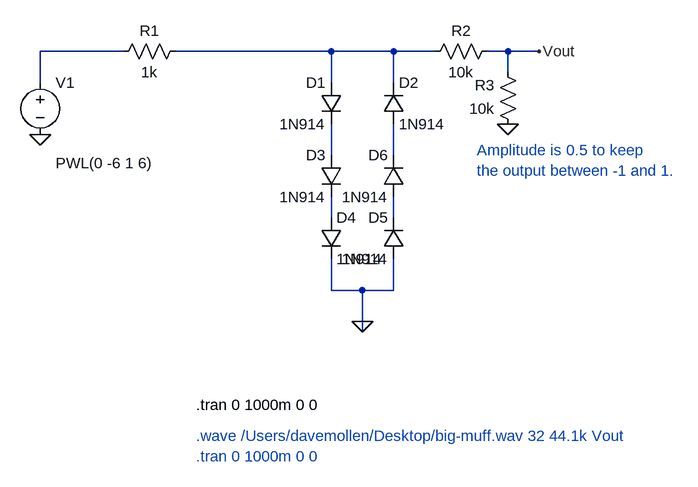
[diagram p0: schematic clipper.asc]
clipper.asc, the LTspice schematic file:
Version 4
SHEET 1 3044 724
WIRE 144 -176 16 -176
WIRE 464 -176 224 -176
WIRE 560 -176 464 -176
WIRE 624 -176 560 -176
WIRE 736 -176 704 -176
WIRE 784 -176 736 -176
WIRE 736 -144 736 -176
WIRE 16 -128 16 -176
WIRE 464 -128 464 -176
WIRE 560 -128 560 -176
WIRE 464 -16 464 -64
WIRE 560 -16 560 -64
WIRE 464 80 464 48
WIRE 560 80 560 48
WIRE 464 192 464 144
WIRE 512 192 464 192
WIRE 560 192 560 144
WIRE 560 192 512 192
WIRE 512 240 512 192
WIRE 512 256 512 240
FLAG 16 -48 0
FLAG 784 -176 Vout
FLAG 512 240 0
FLAG 736 -64 0
SYMBOL voltage 16 -144 R0
WINDOW 3 24 140 Left 2
SYMATTR Value PWL(0 -6 1 6)
SYMATTR Value2 AC 1 0
SYMATTR InstName V1
SYMBOL diode 480 -128 M0
SYMATTR InstName D1
SYMATTR Value 1N914
SYMBOL diode 544 -64 M180
WINDOW 0 24 64 Left 2
WINDOW 3 24 0 Left 2
SYMATTR InstName D2
SYMATTR Value 1N914
SYMBOL res 240 -192 R90
WINDOW 0 0 56 VBottom 2
WINDOW 3 32 56 VTop 2
SYMATTR InstName R1
SYMATTR Value 1k
SYMBOL diode 480 -16 M0
SYMATTR InstName D3
SYMATTR Value 1N914
SYMBOL diode 448 80 R0
SYMATTR InstName D4
SYMATTR Value 1N914
SYMBOL diode 576 144 R180
WINDOW 0 24 64 Left 2
WINDOW 3 24 0 Left 2
SYMATTR InstName D5
SYMATTR Value 1N914
SYMBOL diode 576 48 R180
WINDOW 0 24 64 Left 2
WINDOW 3 24 0 Left 2
SYMATTR InstName D6
SYMATTR Value 1N914
SYMBOL res 720 -192 R90
WINDOW 0 0 56 VBottom 2
WINDOW 3 32 56 VTop 2
SYMATTR InstName R2
SYMATTR Value 10k
SYMBOL res 752 -48 R180
WINDOW 0 36 76 Left 2
WINDOW 3 36 40 Left 2
SYMATTR InstName R3
SYMATTR Value 10k
TEXT 256 368 Left 2 !.tran 0 1000m 0 0
TEXT 256 416 Left 2 ;.wave /Users/davemollen/Desktop/big-muff.wav 32 44.1k Vout\n.tran 0 1000m 0 0
TEXT 688 -24 Left 2 ;Amplitude is 0.5 to keep \nthe output between -1 and 1.

The netlist it stands for:
* clipper.asc
V1 N001 0 PWL(0 -6 1 6) AC 1 0
D1 N002 N003 1N914
D2 N004 N002 1N914
R1 N002 N001 1k
D3 N003 N005 1N914
D4 N005 0 1N914
D5 0 N006 1N914
D6 N006 N004 1N914
R2 Vout N002 10k
R3 0 Vout 10k
.model D D
.lib standard.dio
.tran 0 1000m 0 0
* .wave /Users/davemollen/Desktop/big-muff.wav 32 44.1k Vout
* .tran 0 1000m 0 0
* Amplitude is 0.5 to keep
* the output between -1 and 1.
.backanno
.end